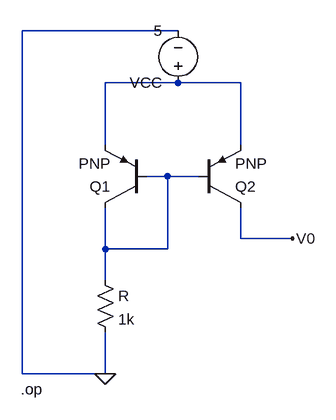
[diagram p0: schematic Assignment1.asc]
Assignment1.asc, the LTspice schematic file:
Version 4
SHEET 1 880 680
WIRE 96 -304 -144 -304
WIRE 96 -224 -16 -224
WIRE 192 -224 96 -224
WIRE -16 -128 -16 -224
WIRE 192 -128 192 -224
WIRE 80 -80 48 -80
WIRE 128 -80 80 -80
WIRE 192 16 192 -32
WIRE 272 16 192 16
WIRE -16 32 -16 -32
WIRE 80 32 80 -80
WIRE 80 32 -16 32
WIRE -16 80 -16 32
WIRE -144 224 -144 -304
WIRE -16 224 -16 160
WIRE -16 224 -144 224
FLAG -16 224 0
FLAG 272 16 V0
SYMBOL res -32 64 R0
SYMATTR InstName R
SYMATTR Value 1k
SYMBOL pnp 48 -32 R180
SYMATTR InstName Q1
SYMBOL pnp 128 -32 M180
SYMATTR InstName Q2
SYMBOL voltage 96 -208 R180
WINDOW 123 0 0 Left 2
WINDOW 39 0 0 Left 2
SYMATTR InstName VCC
SYMATTR Value 5
TEXT -146 248 Left 2 !.op

The netlist it stands for:
* Assignment1.asc
R N002 0 1k
Q1 N002 N002 N001 0 PNP
Q2 V0 N002 N001 0 PNP
VCC N001 0 5
.model NPN NPN
.model PNP PNP
.lib standard.bjt
.op
.backanno
.end